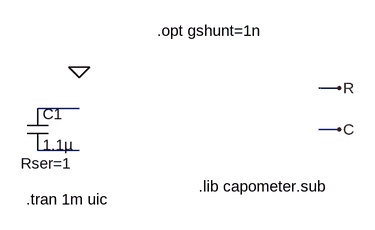
[diagram p0: schematic Draft1.asc]
Draft1.asc, the LTspice schematic file:
Version 4
SHEET 1 880 680
WIRE 496 128 464 128
WIRE 96 160 32 160
WIRE 496 192 464 192
WIRE 96 224 32 224
FLAG 96 96 0
FLAG 496 128 R
FLAG 496 192 C
SYMBOL cap 16 160 R0
WINDOW 39 -10 84 Left 2
SYMATTR InstName C1
SYMATTR Value 1.1µ
SYMATTR SpiceLine Rser=1
TEXT 14 300 Left 2 !.tran 1m uic
TEXT 280 280 Left 2 !.lib capometer.sub
TEXT 216 40 Left 2 !.opt gshunt=1n

The netlist it stands for:
* Draft1.asc
C1 N001 N002 1.1µ Rser=1
.tran 1m uic
.lib capometer.sub
.opt gshunt=1n
.backanno
.end